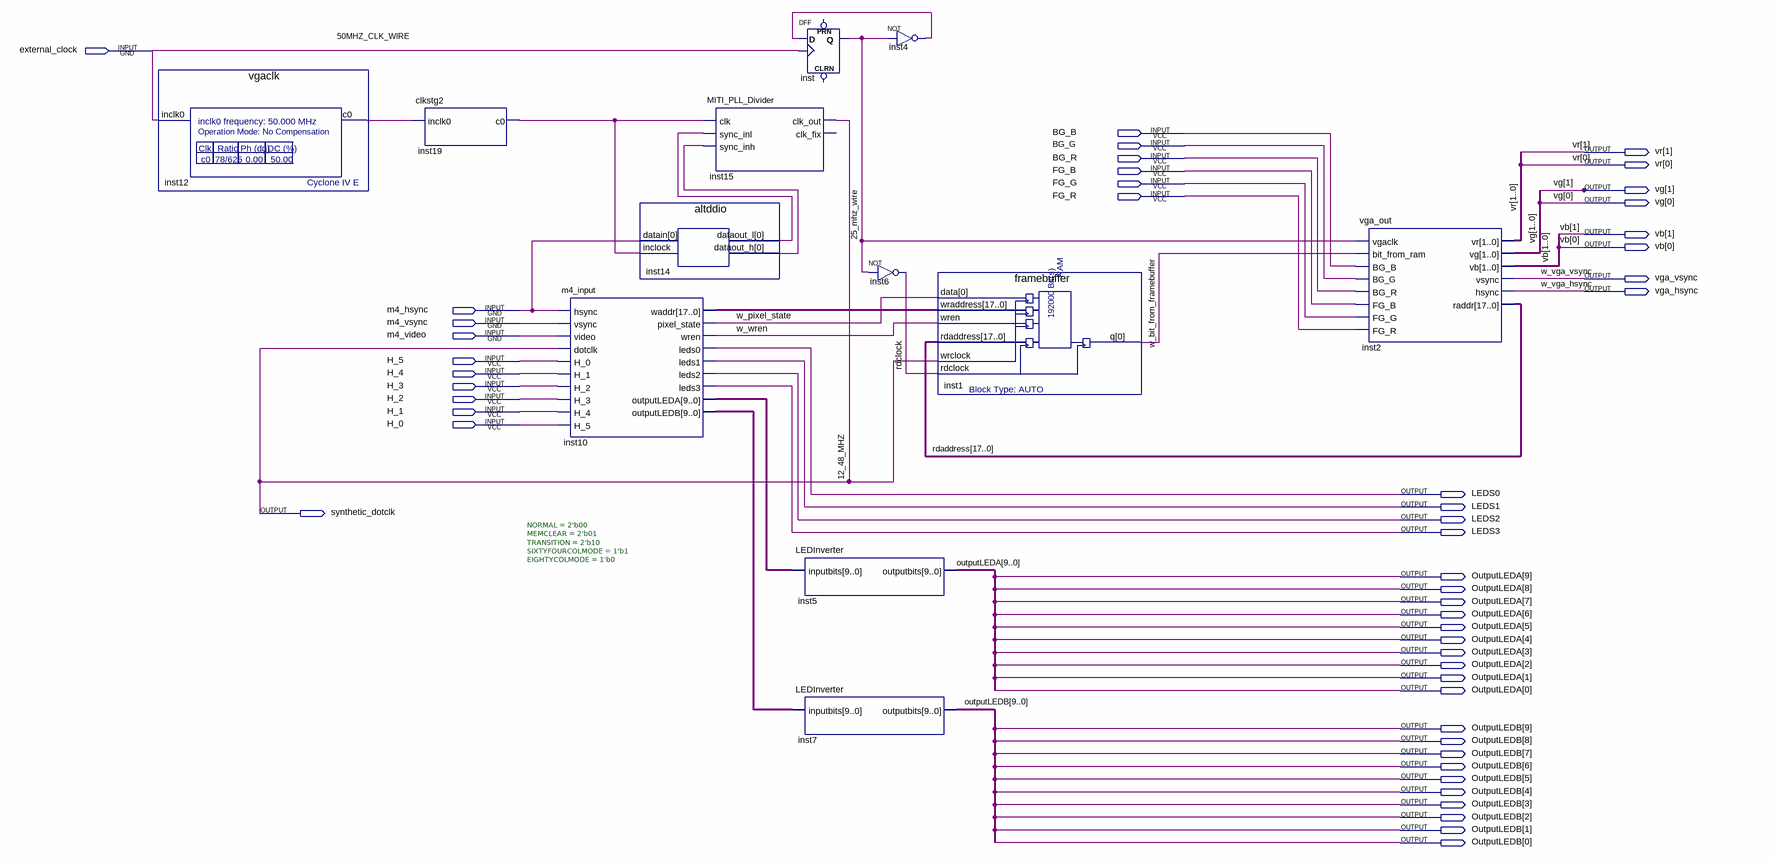
[diagram p0: schematic sheet]
// Quartus schematic M4ToVGA_top.bdf as structural Verilog: 12 symbols, 49 pins
module M4ToVGA_top (
  input  external_clock,
  input  BG_B,
  input  BG_G,
  input  BG_R,
  input  FG_B,
  input  FG_G,
  input  FG_R,
  input  m4_hsync,
  input  m4_vsync,
  input  m4_video,
  input  H_5,
  input  H_4,
  input  H_3,
  input  H_2,
  input  H_1,
  input  H_0,
  output [1:0] vr,
  output [1:0] vg,
  output [1:0] vb,
  output vga_vsync,
  output vga_hsync,
  output LEDS0,
  output LEDS1,
  output synthetic_dotclk,
  output LEDS2,
  output LEDS3,
  output [9:0] OutputLEDA,
  output [9:0] OutputLEDB
);

  wire \25_mhz_wire , inst4_out, inst12_c0, inst14_dataout_h, inst14_dataout_l, inst19_c0, rdclock,
       w_bit_from_framebuffer, w_pixel_state, w_wren;
  wire [9:0] inst10_outputleda, inst10_outputledb;
  wire [17:0] inst10_waddr, rdaddress;

  vgaclk inst12 (.inclk0(external_clock), .c0(inst12_c0));
  clkstg2 inst19 (.inclk0(inst12_c0), .c0(inst19_c0));
  m4_input #(.NORMAL(2'b00), .MEMCLEAR(2'b01), .TRANSITION(2'b10), .SIXTYFOURCOLMODE(1'b1), .EIGHTYCOLMODE(1'b0)) inst10 (
    .hsync(m4_hsync), .vsync(m4_vsync), .video(m4_video), .dotclk(synthetic_dotclk), .H_0(H_5), .H_1(H_4),
    .H_2(H_3), .H_3(H_2), .H_4(H_1), .H_5(H_0), .waddr(inst10_waddr), .pixel_state(w_pixel_state),
    .wren(w_wren), .leds0(LEDS0), .leds1(LEDS1), .leds2(LEDS2), .leds3(LEDS3),
    .outputLEDA(inst10_outputleda), .outputLEDB(inst10_outputledb));
  altddio inst14 (.datain(m4_hsync), .inclock(inst19_c0), .dataout_l(inst14_dataout_l), .dataout_h(inst14_dataout_h));
  MITI_PLL_Divider inst15 (
    .clk(inst19_c0), .sync_inl(inst14_dataout_l), .sync_inh(inst14_dataout_h), .clk_out(synthetic_dotclk));  // open: clk_fix
  DFF inst (.CLK(external_clock), .D(inst4_out), .Q(\25_mhz_wire ));  // open: CLRN, PRN
  LEDInverter inst5 (.inputbits(inst10_outputleda), .outputbits(OutputLEDA));
  LEDInverter inst7 (.inputbits(inst10_outputledb), .outputbits(OutputLEDB));
  not inst4 (inst4_out, \25_mhz_wire );
  not inst6 (rdclock, \25_mhz_wire );
  framebuffer inst1 (
    .data(w_pixel_state), .wraddress(inst10_waddr), .wren(w_wren), .rdaddress(rdaddress),
    .wrclock(synthetic_dotclk), .rdclock(rdclock), .q(w_bit_from_framebuffer));
  vga_out inst2 (
    .vgaclk(\25_mhz_wire ), .bit_from_ram(w_bit_from_framebuffer), .BG_B(BG_B), .BG_G(BG_G), .BG_R(BG_R),
    .FG_B(FG_B), .FG_G(FG_G), .FG_R(FG_R), .vr(vr), .vg(vg), .vb(vb), .vsync(vga_vsync), .hsync(vga_hsync),
    .raddr(rdaddress));

  // Other names for the same wires on the sheet: 12_48_MHZ = synthetic_dotclk; 50MHZ_CLK_WIRE = external_clock;
  //   w_vga_hsync = vga_hsync; w_vga_vsync = vga_vsync
endmodule
